# EAGLE schematic m4_Dev_Board (EAGLE 6.2)
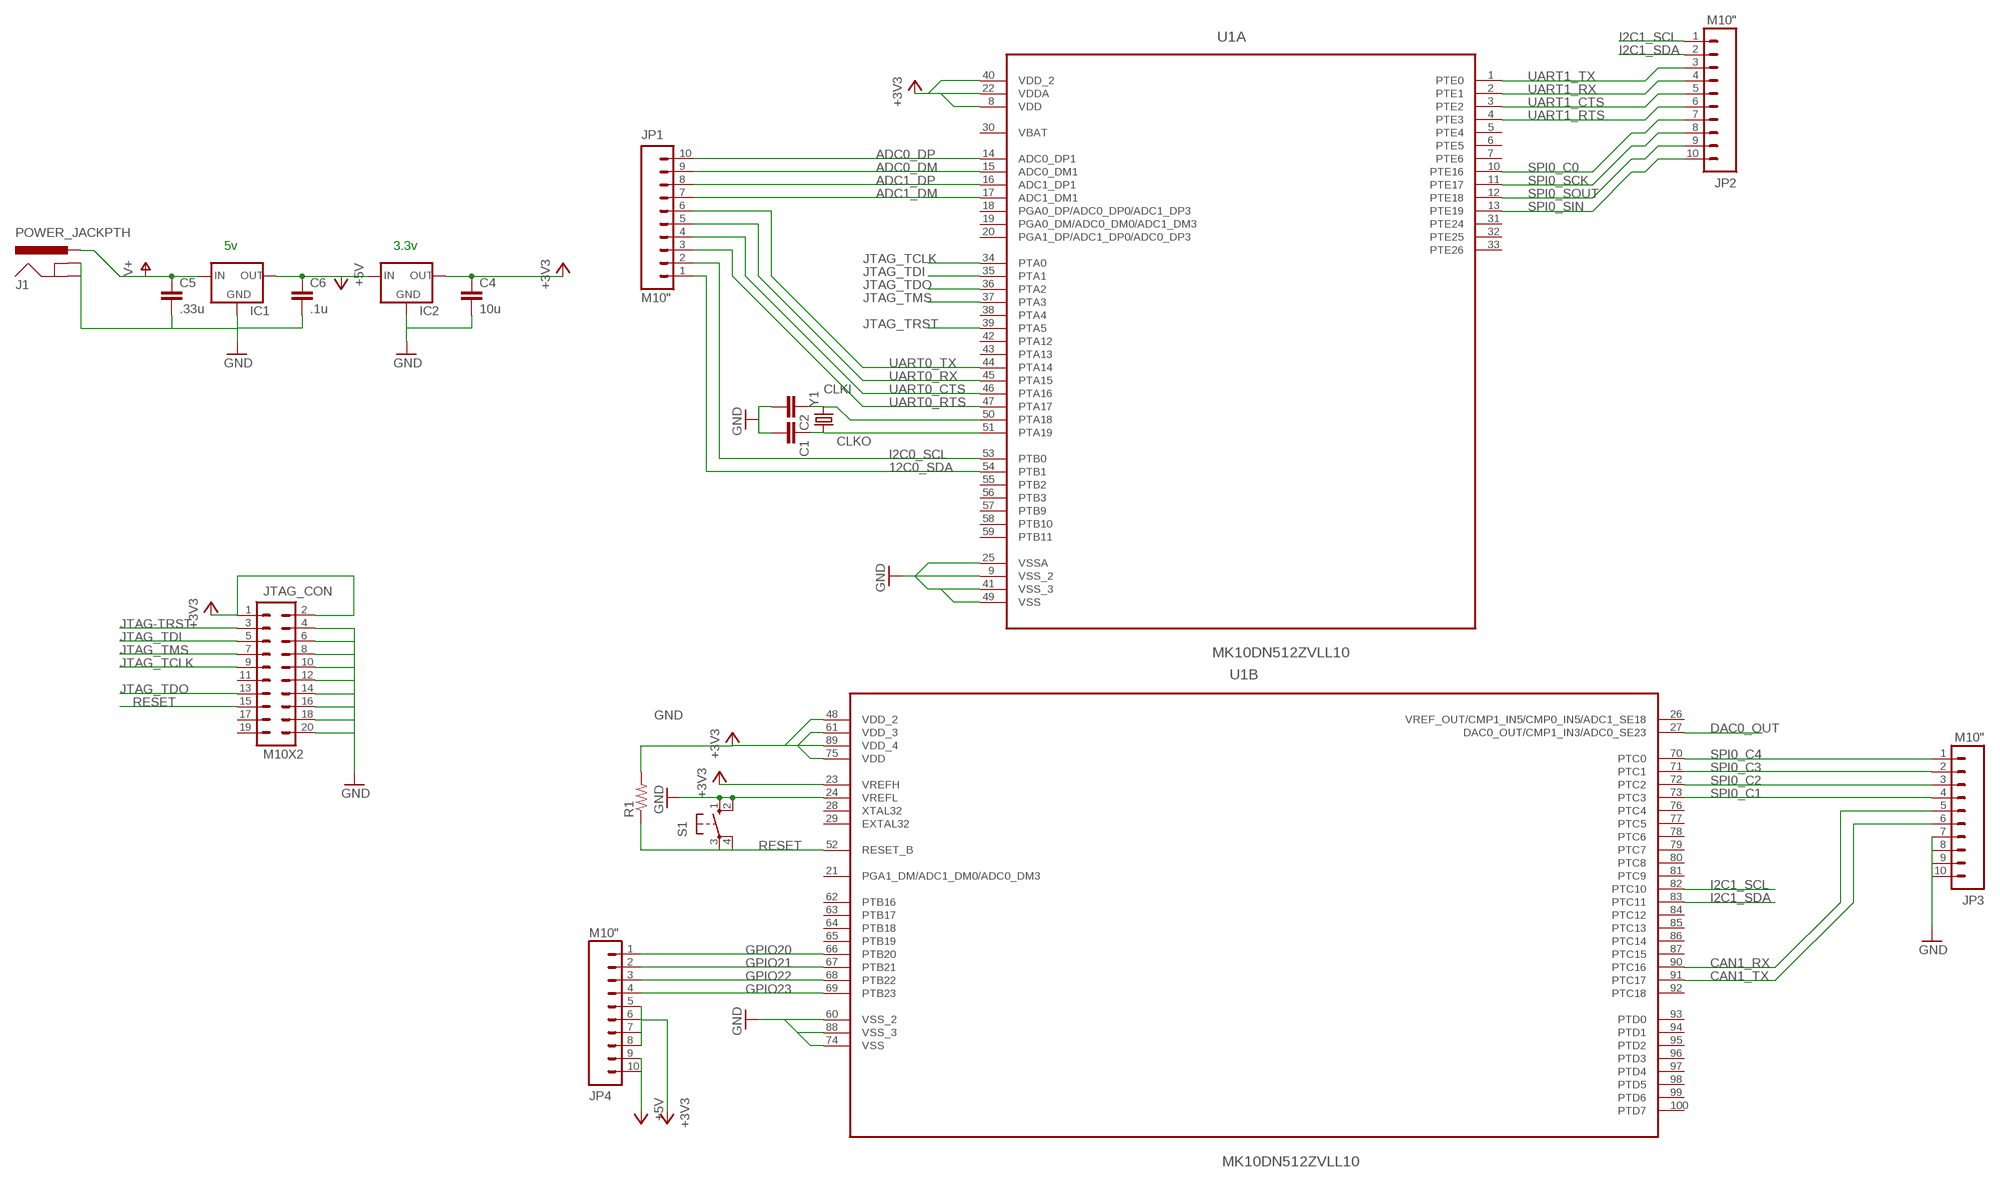
[diagram p0: schematic, sheet 1]

## Parts
C1  CAPPTH1  [CAP-PTH-5MM]
C2  CAPPTH1  [CAP-PTH-5MM]
C4  10u  CAPPTH1  [CAP-PTH-5MM]
C5  .33u  CAPPTH1  [CAP-PTH-5MM]
C6  .1u  CAPPTH1  [CAP-PTH-5MM]
IC1  V_REG_78XXSINK  [TO220-IGO]
IC2  V_REG_78XXSINK  [TO220-IGO]
J1  POWER_JACKPTH  [POWER_JACK_PTH]
JP1  M10"  [1X10]
JP2  M10"  [1X10]
JP3  M10"  [1X10]
JP4  M10"  [1X10]
JTAG_CON  M10X2  [2X10]
R1  RESISTORPTH-1/4W  [AXIAL-0.4]
S1  10-XX  [B3F-10XX]
U1  MK10DN512ZVLL10  [QFP50P1600X1600X170-100N]
Y1  CRYSTALHC49US  [HC49US]

## Nets
12C0_SDA: JP1.1 U1.54(A:PTB1)
+3V3: C4.1 IC2.OUT JP4.5 JP4.6 JP4.7 JP4.8 JTAG_CON.1 JTAG_CON.2 R1.P$2 U1.8(A:VDD) U1.22(A:VDDA) U1.23(B:VREFH) U1.40(A:VDD_2) U1.48(B:VDD_2) U1.61(B:VDD_3) U1.75(B:VDD) U1.89(B:VDD_4)
+5V: C6.1 IC1.OUT IC2.IN JP4.9 JP4.10
ADC0_DM: JP1.9 U1.15(A:ADC0_DM1)
ADC0_DP: JP1.10 U1.14(A:ADC0_DP1)
ADC1_DM: JP1.7 U1.17(A:ADC1_DM1)
ADC1_DP: JP1.8 U1.16(A:ADC1_DP1)
CAN1_RX: JP3.5 U1.90(B:PTC16)
CAN1_TX: JP3.6 U1.91(B:PTC17)
CLKI: C2.1 U1.50(A:PTA18) Y1.2
CLKO: C1.1 U1.51(A:PTA19) Y1.1
DAC0_OUT: U1.27(B:DAC0_OUT/CMP1_IN3/ADC0_SE23)
GND: C1.2 C2.2 C4.2 C5.2 C6.2 IC1.GND IC2.GND J1.GND J1.GNDBREAK JP3.7 JP3.8 JP3.9 JP3.10 JTAG_CON.4 JTAG_CON.6 JTAG_CON.8 JTAG_CON.10 JTAG_CON.12 JTAG_CON.14 JTAG_CON.16 JTAG_CON.18 JTAG_CON.20 S1.1(S) S1.2(S1) U1.9(A:VSS_2) U1.24(B:VREFL) U1.25(A:VSSA) U1.41(A:VSS_3) U1.49(A:VSS) U1.60(B:VSS_2) U1.74(B:VSS) U1.88(B:VSS_3)
GPIO20: JP4.1 U1.66(B:PTB20)
GPIO21: JP4.2 U1.67(B:PTB21)
GPIO22: JP4.3 U1.68(B:PTB22)
GPIO23: JP4.4 U1.69(B:PTB23)
I2C0_SCL: JP1.2 U1.53(A:PTB0)
I2C1_SCL: JP2.1 U1.82(B:PTC10)
I2C1_SDA: JP2.2 U1.83(B:PTC11)
JTAG-TRST: JTAG_CON.3
JTAG_TCLK: JTAG_CON.9 U1.34(A:PTA0)
JTAG_TDI: JTAG_CON.5 U1.35(A:PTA1)
JTAG_TDO: JTAG_CON.13 U1.36(A:PTA2)
JTAG_TMS: JTAG_CON.7 U1.37(A:PTA3)
JTAG_TRST: U1.39(A:PTA5)
RESET: JTAG_CON.15 R1.P$1 S1.3(P) S1.4(P1) U1.52(B:RESET_B)
SPI0_C0: JP2.7 U1.10(A:PTE16)
SPI0_C1: JP3.4 U1.73(B:PTC3)
SPI0_C2: JP3.3 U1.72(B:PTC2)
SPI0_C3: JP3.2 U1.71(B:PTC1)
SPI0_C4: JP3.1 U1.70(B:PTC0)
SPI0_SCK: JP2.8 U1.11(A:PTE17)
SPI0_SIN: JP2.10 U1.13(A:PTE19)
SPI0_SOUT: JP2.9 U1.12(A:PTE18)
UART0_CTS: JP1.4 U1.46(A:PTA16)
UART0_RTS: JP1.3 U1.47(A:PTA17)
UART0_RX: JP1.5 U1.45(A:PTA15)
UART0_TX: JP1.6 U1.44(A:PTA14)
UART1_CTS: JP2.5 U1.3(A:PTE2)
UART1_RTS: JP2.6 U1.4(A:PTE3)
UART1_RX: JP2.4 U1.2(A:PTE1)
UART1_TX: JP2.3 U1.1(A:PTE0)
V+: C5.1 IC1.IN J1.PWR
Unconnected: JTAG_CON.11 JTAG_CON.17 JTAG_CON.19 U1.5(A:PTE4) U1.6(A:PTE5) U1.7(A:PTE6) U1.18(A:PGA0_DP/ADC0_DP0/ADC1_DP3) U1.19(A:PGA0_DM/ADC0_DM0/ADC1_DM3) U1.20(A:PGA1_DP/ADC1_DP0/ADC0_DP3) U1.21(B:PGA1_DM/ADC1_DM0/ADC0_DM3) U1.26(B:VREF_OUT/CMP1_IN5/CMP0_IN5/ADC1_SE18) U1.28(B:XTAL32) U1.29(B:EXTAL32) U1.31(A:PTE24) U1.32(A:PTE25) U1.33(A:PTE26) U1.38(A:PTA4) U1.42(A:PTA12) U1.43(A:PTA13) U1.55(A:PTB2) U1.56(A:PTB3) U1.57(A:PTB9) U1.58(A:PTB10) U1.59(A:PTB11) U1.62(B:PTB16) U1.63(B:PTB17) U1.64(B:PTB18) U1.65(B:PTB19) U1.76(B:PTC4) U1.77(B:PTC5) U1.78(B:PTC6) U1.79(B:PTC7) U1.80(B:PTC8) U1.81(B:PTC9) U1.84(B:PTC12) U1.85(B:PTC13) U1.86(B:PTC14) U1.87(B:PTC15) U1.92(B:PTC18) U1.93(B:PTD0) U1.94(B:PTD1) U1.95(B:PTD2) U1.96(B:PTD3) U1.97(B:PTD4) U1.98(B:PTD5) U1.99(B:PTD6) U1.100(B:PTD7)

## Notes on the sheet
- 5v | 3.3v

## Power pins joined to a net without a drawn wire
VBAT: U1.30(A:VBAT)

## Library data of the parts
C1 C2 C4-C6 = SparkFun-Passives:CAP: Capacitor Standard 0603 ceramic capacitor, and 0.1" leaded capacitor.
IC1 IC2 = SparkFun-PowerIC:V_REG_78XX: Voltage Regulator Standard 7805 5V regulator. IGO (Input Ground Output). Spark Fun Electronics SKU : COM-00107
J1 = SparkFun-Connectors:POWER_JACK: Power Jack This is the standard 5.5mm barrel jack for power. The PTH is the most common, proven, reliable, footprint. The Slot footprint only works if the mill layer is transmitted to the PCB fab house so be warned. Spark Fun Electronics SKU : PRT-00119 SMT: CONN-08106 Mating wall wart : TOL-00298 (and others)
JP1-JP4 = SparkFun-Connectors:M10: Header 10 Standard 10-pin 0.1" header. Use with straight break away headers (SKU : PRT-00116), right angle break away headers (PRT-00553), swiss pins (PRT-00743), machine pins (PRT-00117), and female headers (PRT-00115).
JTAG_CON = SparkFun-Connectors:M10X2: This was SPECIALLY designed to be used with our Graphic LCD Backpack. Be sure you want to use this! It is not only staggered on each line of header holes, but IT IS ALSO offset of the center point of the top and bottom lines by 5 mil. This causes the headers to lock into place on the "standard" footprint on the LCD screen. The extra squares on the tdocu layer are there simply to reference other pins (if you were to actually populate a longer header than ten long - this is what we do with the backpacks).
R1 = SparkFun-Resistors:RESISTOR: Resistor Basic schematic elements and footprints for 0603, 1206, and PTH resistors.
S1 = switch-omron:10-XX: OMRON SWITCH; MPN: B3F-1000; OC_FARNELL: 176432; OC_NEWARK: 36M3542
U1 = freescale_lqfp_m4:MK10DN512ZVLL10: MCU, 32 BIT, KINETIS, K10, LQFP-100; MPN: MK10DN512ZVLL10; OC_FARNELL: 2070276; OC_NEWARK: 75T7577; PACKAGE: LQFP-100; SUPPLIER: FREESCALE SEMICONDUCTOR
Y1 = SparkFun-FreqCtrl:CRYSTAL: Various standard crystals. Proven footprints. Spark Fun Electronics SKU : COM-00534